# EAGLE design standalone (EAGLE 6.3)
AUTHOR: Ashley Grealish; VERSION: 0.1
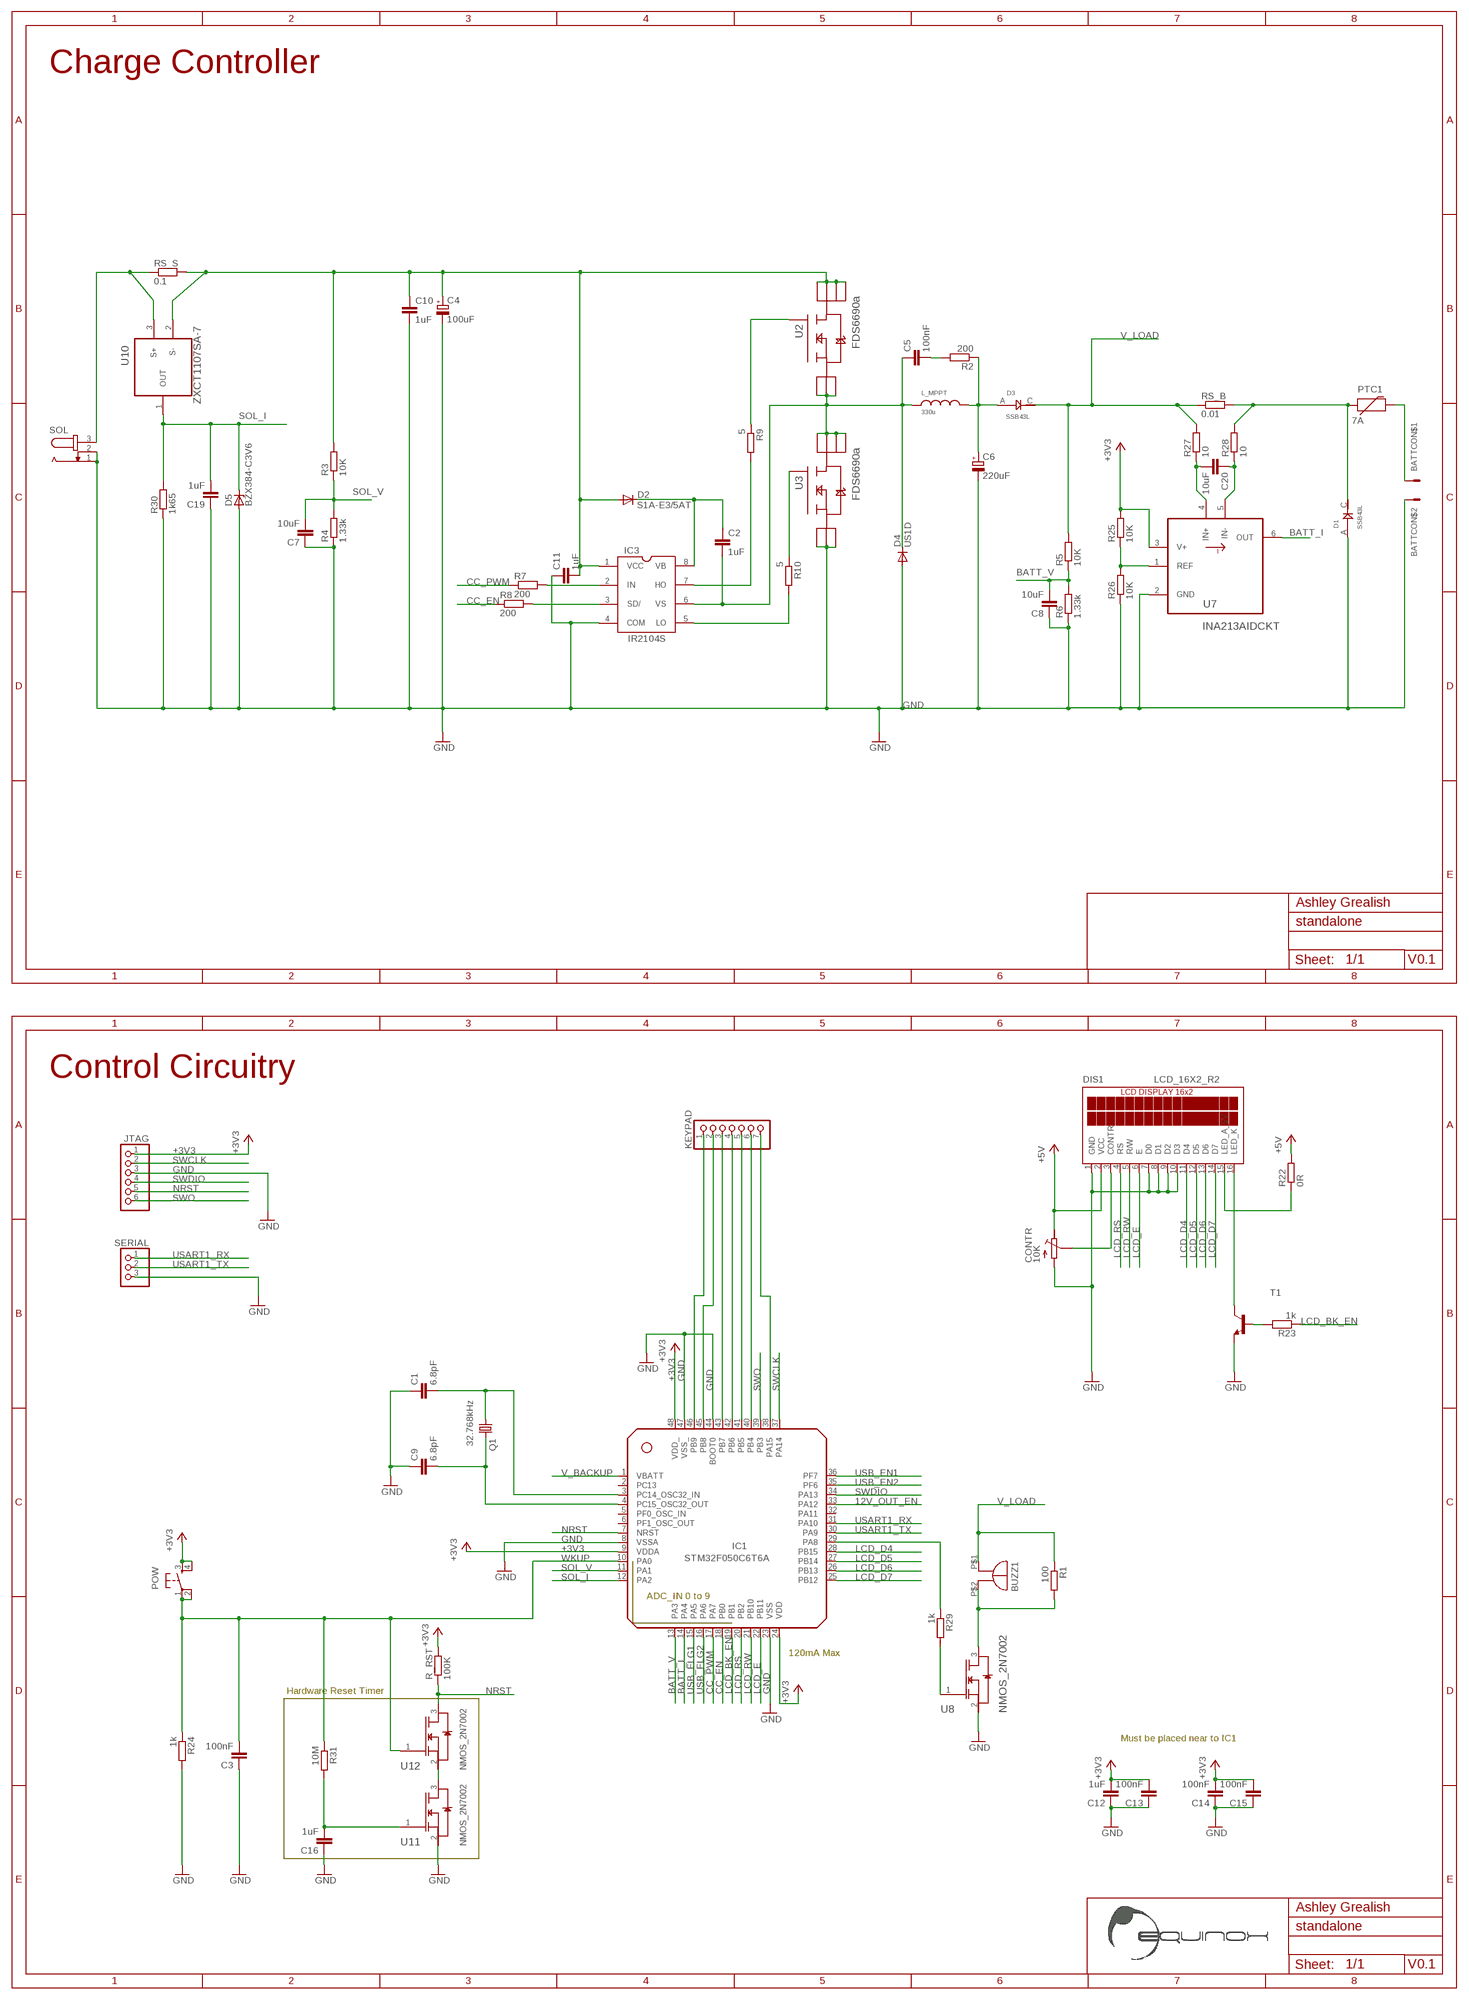
[diagram p0: schematic, sheet 1, part 1 of 2]
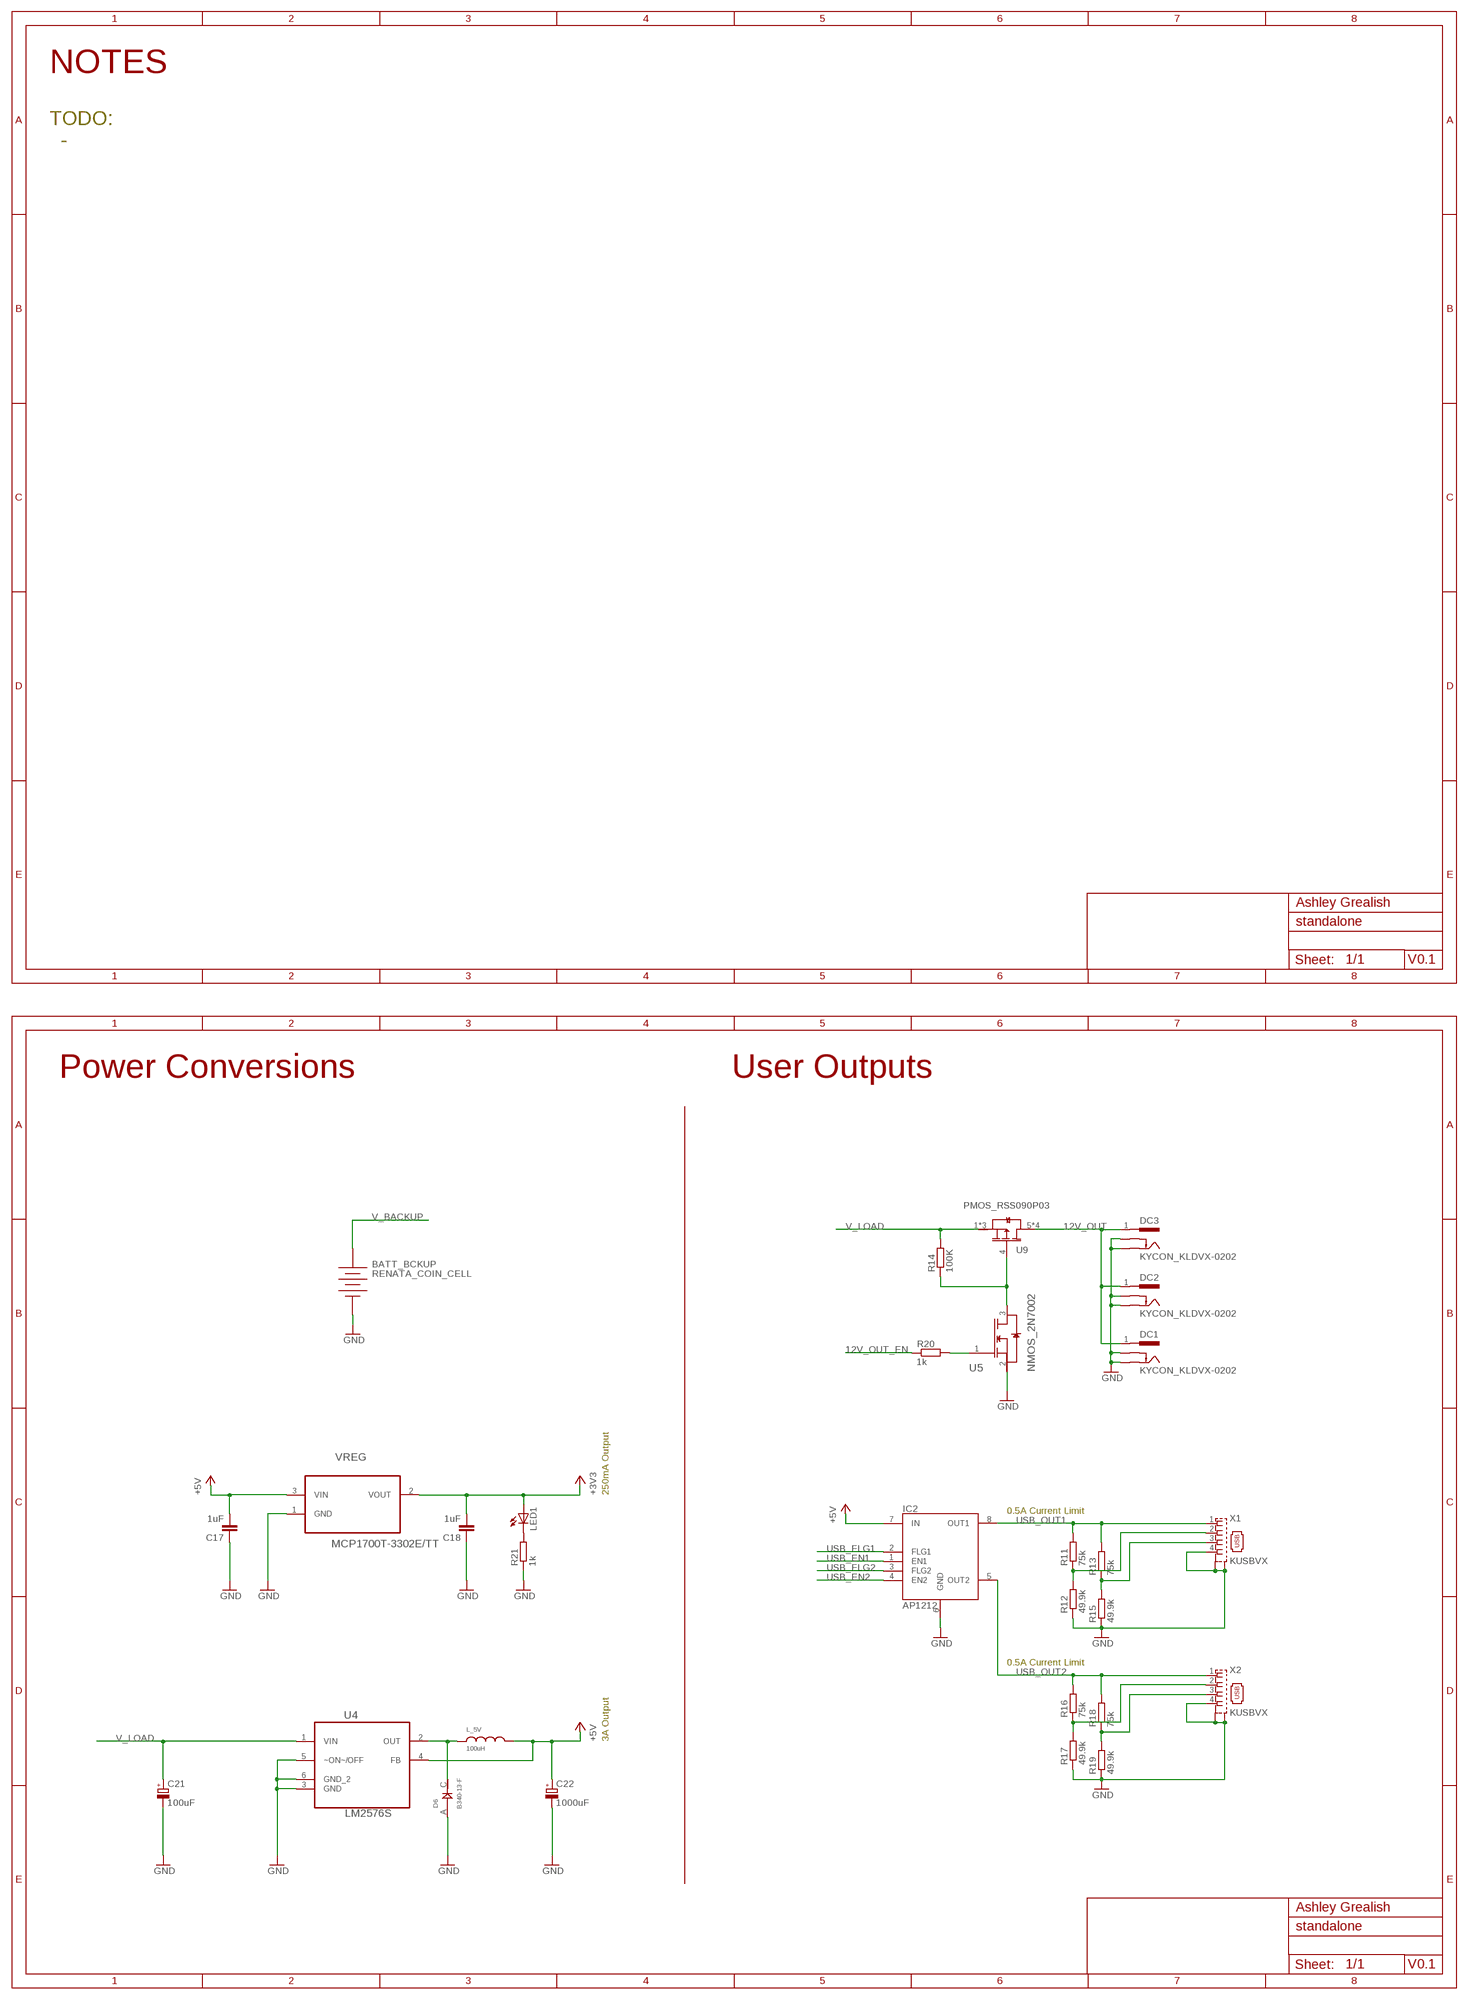
[diagram p1: schematic, sheet 1, part 2 of 2]

## Parts
BATT  CON_MOLEX_39_29_1028  [MOLEX_39_29_1028]
BATT_BCKUP  RENATA_COIN_CELL  PANASONIC_CR2032_1298246  [PANASONIC_CR2032_1298246]
BUZZ1  BUZZ_14MM  [BUZZ_14MM_5M_PINS]
C1  6.8pF  C-EUC0603K  [C0603K]
C2  1uF  C-EUC0805K  [C0805K]
C3  100nF  C-EUC0805K  [C0805K]
C4  100uF  CPOL-EUE  [PANASONIC_E]
C5  100nF  C-EUC0805K  [C0805K]
C6  220uF  CPOL-EUF  [PANASONIC_F]
C7  10uF  C-EUC0805K  [C0805K]
C8  10uF  C-EUC0805K  [C0805K]
C9  6.8pF  C-EUC0603K  [C0603K]
C10  1uF  C-EUC0805K  [C0805K]
C11  1uF  C-EUC0805K  [C0805K]
C12  1uF  C-EUC0805K  [C0805K]
C13  100nF  C-EUC0805K  [C0805K]
C14  100nF  C-EUC0805K  [C0805K]
C15  100nF  C-EUC0805K  [C0805K]
C16  1uF  C-EUC0805K  [C0805K]
C17  1uF  C-EUC0805K  [C0805K]
C18  1uF  C-EUC0805K  [C0805K]
C19  1uF  C-EUC0805K  [C0805K]
C20  10uF  C-EUC0805K  [C0805K]
C21  100uF  CPOL-EUE  [PANASONIC_E]
C22  1000uF  CPOL-EUG  [PANASONIC_G]
CONTR  10K  R_TRIMM_TC33X  [R_TRIMM_RC33X]
D1  SSB43L  DIODE_SSB43L  [DO214AA]
D2  S1A-E3/5AT  DIODE-DO-214AC  [DO-214AC]
D3  SSB43L  DIODE_SSB43L  [DO214AA]
D4  US1D  DIODE-DO-214AC  [DO-214AC]
D5  BZX384-C3V6  [SOD323]
D6  B340-13-F  DIODE_B340-13-F  [SMC]
DC1  KYCON_KLDVX-0202  [KYCON_KLVDX_2020_B]
DC2  KYCON_KLDVX-0202  [KYCON_KLVDX_2020_B]
DC3  KYCON_KLDVX-0202  [KYCON_KLVDX_2020_B]
DIS1  LCD_16X2_R2  [LCD_16X2_R2]
IC1  STM32F050C6T6A  [LQFP48]
IC2  AP1212  [SO8]
IC3  IR2104S  [IR2104S]
JTAG  PINHD-1X6  [1X06]
KEYPAD  PINHD-1X7/90  [1X07/90]
L_5V  100uH  INDUC_BOURNES_SDR2207  [INDUC_BOURNS_SDR2207]
L_MPPT  330u  INDUC_BOURNES_SDR1806  [INDUC_BOURNS_SDR1806]
LED1  POW_3V3  LEDCHIPLED_0805  [CHIPLED_0805]
POW  TAC_SWITCHPTH  [TACTILE-PTH]
PTC1  7A  PTC_MF_R700  [PTC_MF_R700]
Q1  32.768kHz  MC-306  [MC-306]
R1  100  R-EU_M0805  [M0805]
R2  200  R-EU_M0805  [M0805]
R3  10K  R-EU_M0805  [M0805]
R4  1.33k  R-EU_M0805  [M0805]
R5  10K  R-EU_M0805  [M0805]
R6  1.33k  R-EU_M0805  [M0805]
R7  200  R-EU_M0805  [M0805]
R8  200  R-EU_M0805  [M0805]
R9  5  R-EU_M0805  [M0805]
R10  5  R-EU_M0805  [M0805]
R11  75k  R-EU_M0805  [M0805]
R12  49.9k  R-EU_M0805  [M0805]
R13  75k  R-EU_M0805  [M0805]
R14  100K  R-EU_M0805  [M0805]
R15  49.9k  R-EU_M0805  [M0805]
R16  75k  R-EU_M0805  [M0805]
R17  49.9k  R-EU_M0805  [M0805]
R18  75k  R-EU_M0805  [M0805]
R19  49.9k  R-EU_M0805  [M0805]
R20  1k  R-EU_M0805  [M0805]
R21  1k  R-EU_M0805  [M0805]
R22  0R  R-EU_M0805  [M0805]
R23  1k  R-EU_M0805  [M0805]
R24  1k  R-EU_M0805  [M0805]
R25  10K  R-EU_M0805  [M0805]
R26  10K  R-EU_M0805  [M0805]
R27  10  R-EU_M0805  [M0805]
R28  10  R-EU_M0805  [M0805]
R29  1k  R-EU_M0805  [M0805]
R30  1k65  R-EU_M0805  [M0805]
R31  10M  R-EU_M0805  [M0805]
R_RST  100K  R-EU_M0805  [M0805]
RS_B  0.01  R-EU_R2512  [R2512]
RS_S  0.1  R-EU_R2512  [R2512]
SERIAL  PINHD-1X3  [1X03]
SOL  JACK-PLUG0  [SPC4077]
T1  BC847B-NPN-SOT23-BEC  [SOT23-BEC]
U2  FDS6690a  DMS3016SSS-13  [SOIC127P600X175-8N]
U3  FDS6690a  DMS3016SSS-13  [SOIC127P600X175-8N]
U4  LM2576S  [TO263-5]
U5  NMOS_2N7002  [SOT103P240X110-3N]
U7  INA213AIDCKT  [SOT65P210X110-6N]
U8  NMOS_2N7002  [SOT103P240X110-3N]
U9  PMOS_RSS090P03  [SO8]
U10  ZXCT1107SA-7  [SOT91P240X110-3N]
U11  NMOS_2N7002  [SOT103P240X110-3N]
U12  NMOS_2N7002  [SOT103P240X110-3N]
U$1  EQUINOX_LOGO_LARGE  [EQUINOX_LOGO_LARGE]
VREG  MCP1700T-3302E/TT  [SOT95P237X112-3N]
X1  KUSBVX  [KUSBVX]
X2  KUSBVX  [KUSBVX]

## Nets
12V_OUT [pow_12v]: DC1.1(PAD1) DC2.1(PAD1) DC3.1(PAD1) U9.5(D2) U9.6(D2) U9.7(D2) U9.8(D2)
12V_OUT_EN: IC1.33(PA12) R20.1
+3V3: C12.2 C13.2 C14.2 C15.2 C18.2 IC1.9(VDDA) IC1.24(VDD) IC1.48(VDD_) JTAG.1 LED1.A POW.3 POW.4 R25.2 R_RST.2 U7.3(V+) VREG.2(VOUT)
+5V: C17.2 C22.+ CONTR.CW(A) DIS1.2(VCC) IC2.7(IN) L_5V.P$2 R22.2 U4.4(FB) VREG.3(VIN)
BATT_I: IC1.14(PA4) U7.6(OUT)
BATT_V: C8.2 IC1.13(PA3) R5.1 R6.2
CC_EN: IC1.18(PB0) R8.1
CC_PWM: IC1.17(PA7) R7.1
GND [pwr]: BATT.P$2 BATT_BCKUP.P-(NEG) C1.1 C3.1 C4.- C6.- C7.1 C8.1 C9.1 C10.2 C11.1 C12.1 C13.1 C14.1 C15.1 C16.1 C17.1 C18.1 C19.1 C21.- C22.- CONTR.CCW(E) D1.A(ANODE) D4.A D5.A D6.A(ANODE) DC1.2(PAD2) DC1.3(PAD3) DC2.2(PAD2) DC2.3(PAD3) DC3.2(PAD2) DC3.3(PAD3) DIS1.1(GND) DIS1.7(D0) DIS1.8(D1) DIS1.9(D2) DIS1.10(D3) IC1.8(VSSA) IC1.23(VSS) IC1.44(BOOT0) IC1.47(VSS_) IC2.6(GND) IC3.4(COM) JTAG.3 R4.1 R6.1 R12.1 R15.1 R17.1 R19.1 R21.1 R24.2 R26.1 R30.1 SERIAL.3 SOL.1 SOL.2 T1.E U3.1(S_2) U3.2(S_3) U3.3(S) U4.3(GND) U4.5(~ON~/OFF) U4.6(GND_2) U5.2(S) U7.2(GND) U8.2(S) U11.2(S) VREG.1(GND) X1.4 X1.M1(S1) X1.M2(S2) X2.4 X2.M1(S1) X2.M2(S2)
LCD_BK_EN: IC1.19(PB1) R23.1
LCD_D4: DIS1.11(D4) IC1.28(PB15)
LCD_D5: DIS1.12(D5) IC1.27(PB14)
LCD_D6: DIS1.13(D6) IC1.26(PB13)
LCD_D7: DIS1.14(D7) IC1.25(PB12)
LCD_E: DIS1.6(E) IC1.22(PB11)
LCD_RS: DIS1.4(RS) IC1.20(PB2)
LCD_RW: DIS1.5(R/W) IC1.21(PB10)
N$1: C1.2 IC1.3(PC14_OSC32_IN) Q1.1
N$2: CONTR.WIPE(S) DIS1.3(CONTR)
N$3: IC3.3(SD/) R8.2
N$4 [pwr]: D1.C(CATHODE) PTC1.P$1 R28.2 RS_B.2
N$6 [pwr]: C2.2 C5.1 D4.C IC3.6(VS) L_MPPT.P$1 U2.1(S_2) U2.2(S_3) U2.3(S) U3.5(D_3) U3.6(D_2) U3.7(D_4) U3.8(D)
N$7: IC3.7(HO) R9.2
N$8: IC3.2(IN) R7.2
N$10: C2.1 D2.C IC3.8(VB)
N$11: R10.1 U3.4(G)
N$12: C6.+ D3.A(ANODE) L_MPPT.P$2 R2.1
N$13: IC3.5(LO) R10.2
N$14: R9.1 U2.4(G)
N$15: C5.2 R2.2
N$16 [pwr]: C4.+ C10.1 C11.2 D2.A IC3.1(VCC) R3.2 RS_S.2 U2.5(D_3) U2.6(D_2) U2.7(D_4) U2.8(D) U10.2(S-)
N$18: C9.2 IC1.4(PC15_OSC32_OUT) Q1.4
N$19: DIS1.15(LED_A_5V) R22.1
N$20: R16.1 R17.2 X2.2
N$21: D6.C(CATHODE) L_5V.P$1 U4.2(OUT)
N$22: IC1.29(PA8) R29.1
N$23: IC1.46(PB9) KEYPAD.1
N$24: IC1.45(PB8) KEYPAD.2
N$25: R14.1 U5.3(D) U9.4(G)
N$26: IC1.43(PB7) KEYPAD.3
N$27: IC1.42(PB6) KEYPAD.4
N$28: IC1.41(PB5) KEYPAD.5
N$29: IC1.40(PB4) KEYPAD.6
N$30: IC1.38(PA15) KEYPAD.7
N$31: DIS1.16(LED_K) T1.C
N$32: R23.2 T1.B
N$33: R11.1 R12.2 X1.2
N$34: R13.1 R15.2 X1.3
N$35: R20.2 U5.1(G)
N$36: R18.1 R19.2 X2.3
N$37: LED1.C R21.2
N$38 [pwr]: RS_S.1 SOL.3 U10.3(S+)
N$39: R25.1 R26.2 U7.1(REF)
N$40: C20.2 R27.1 U7.4(IN+)
N$41: C20.1 R28.1 U7.5(IN-)
N$42: BUZZ1.P$2(-) R1.2 U8.3(D)
N$43: R29.2 U8.1(G)
N$44: C16.2 R31.2 U11.1(G)
N$45: U11.3(D) U12.2(S)
N$46 [pwr]: BATT.P$1 PTC1.P$2
NRST: IC1.7(NRST) JTAG.5 R_RST.1 U12.3(D)
SOL_I: C19.2 D5.C IC1.12(PA2) R30.2 U10.1(OUT)
SOL_V: C7.2 IC1.11(PA1) R3.1 R4.2
SWCLK: IC1.37(PA14) JTAG.2
SWDIO: IC1.34(PA13) JTAG.4
SWO: IC1.39(PB3) JTAG.6
USART1_RX: IC1.31(PA10) SERIAL.1
USART1_TX: IC1.30(PA9) SERIAL.2
USB_EN1: IC1.36(PF7) IC2.1(EN1)
USB_EN2: IC1.35(PF6) IC2.4(EN2)
USB_FLG1: IC1.15(PA5) IC2.2(FLG1)
USB_FLG2: IC1.16(PA6) IC2.3(FLG2)
USB_OUT1 [pwr]: IC2.8(OUT1) R11.2 R13.2 X1.1
USB_OUT2 [pwr]: IC2.5(OUT2) R16.2 R18.2 X2.1
V_BACKUP: BATT_BCKUP.P+(POS) IC1.1(VBATT)
V_LOAD: BUZZ1.P$1(+) C21.+ D3.C(CATHODE) R1.1 R5.2 R14.2 R27.2 RS_B.1 U4.1(VIN) U9.1(S2) U9.2(S2) U9.3(S2)
WKUP: C3.2 IC1.10(PA0) POW.1 POW.2 R24.1 R31.1 U12.1(G)
Unconnected: IC1.2(PC13) IC1.5(PF0_OSC_IN) IC1.6(PF1_OSC_OUT) IC1.32(PA11)

## Notes on the sheet
- Charge Controller | NOTES
- TODO:
    -
- V | V
- Control Circuitry | Power Conversions | User Outputs
- 250mA Output
- 0.5A Current Limit
- ADC_IN 0 to 9
- 120mA Max
- 0.5A Current Limit
- Hardware Reset Timer
- Must be placed near to IC1 | 3A Output
- V | V

## Library data of the parts
BATT = equinox:CON_MOLEX_39_29_1028; OC_FARNELL: 1012166
BATT_BCKUP = coin_cells:PANASONIC_CR2032_1298246: Farnell Part No: 1298246; OC_FARNELL: 1298246
BUZZ1 = equinox:BUZZ_14MM; OC_FARNELL: 1192513
C1 C9 = resistor:C-EU: CAPACITOR, European symbol; OC_FARNELL: 1856141
C2 C3 C5 C7 C8 C10-C20 = resistor:C-EU: CAPACITOR, European symbol
C4 C21 = resistor:CPOL-EU: POLARIZED CAPACITOR, European symbol; OC_FARNELL: 1539489
C6 = resistor:CPOL-EU: POLARIZED CAPACITOR, European symbol; OC_FARNELL: 9695877
C22 = resistor:CPOL-EU: POLARIZED CAPACITOR, European symbol; OC_FARNELL: 1244342
CONTR = equinox:R_TRIMM_TC33X; OC_FARNELL: 1689863; OC_MOUSER: 652-TC33X-2-103E
D1 D3 = equinox:DIODE_SSB43L: VISHAY - SSB43L-E3/52T - DIODE, SCHOTTKY, 4A, 30V Farnell: 1336556; OC_FARNELL: 1336556
D2 = diode:DIODE-: DIODE; OC_FARNELL: 9550216
D4 = diode:DIODE-: DIODE; OC_FARNELL: 1625280
D5 = equinox:BZX384-C3V6; OC_FARNELL: 8735654
D6 = equinox:DIODE_B340-13-F; OC_FARNELL: 1843695
DC1-DC3 = equinox:KYCON_KLDVX-0202; TOBY: DC-031-B
DIS1 = equinox:LCD_16X2_R2: Supplier: info <info@huaxinjin.com> Model: 1602C-1; OC_FARNELL: unknown; OC_NEWARK: unknown
IC1 = equinox:STM32F050C6T6A; OC_FARNELL: 2115059
IC2 = equinox:AP1212: Datasheet: http://www.farnell.com/datasheets/608767.pdf Can be replaced with newer AP2156SG-13 RS:http://uk.rs-online.com/web/p/products/7512963P/?cm_mmc=aff-_-uk-_-octopart-_-7512963P; OC_FARNELL: 1825302
IC3 = equinox:IR2104S: Half Bridge Mosfet - IGBT driver SOIC; OC_FARNELL: 8638756
JTAG = pinhead:PINHD-1X6: PIN HEADER
KEYPAD = pinhead:PINHD-1X7: PIN HEADER; OC_FARNELL: 588763
L_5V = equinox:INDUC_BOURNES_SDR2207; FARNELL: 1612709; OC_FARNELL: 1612709
L_MPPT = equinox:INDUC_BOURNES_SDR1806: Datasheet: http://www.bourns.com/data/global/pdfs/SDR1806.pdf Onecall #: 1929705; OC_FARNELL: 1929706
LED1 = led:LED: LED OSRAM: - CHIPLED LG R971, LG N971, LY N971, LG Q971, LY Q971, LO R971, LY R971 LH N974, LH R974 LS Q976, LO Q976, LY Q976 LO Q996 - Hyper CHIPLED LW Q18S LB Q993, LB Q99A, LB R99A - SideLED LS A670, LO A670, LY A670, LG A670, LP A670 LB A673, LV A673, LT A673, LW A673 LH A674 LY A675 LS A676, LA A676, LO A676, LY A676, LW A676 LS A679, LY A679, LG A679 - Hyper Micro SIDELED® LS Y876, LA Y876, LO Y876, LY Y876 LT Y87S - SmartLED LW L88C, LW L88S LB L89C, LB L89S, LG L890 LS L89K, LO L89K, LY L89K LS L896, LA L896, LO L896, LY L896 - TOPLED LS T670, LO T670, LY T670, LG T670, LP T670 LSG T670, LSP T670, LSY T670, LOP T670, LYG T670 LG T671, LOG T671, LSG T671 LB T673, LV T673, LT T673, LW T673 LH T674 LS T676, LA T676, LO T676, LY T676, LB T676, LH T676, LSB T676, LW T676 LB T67C, LV T67C, LT T67C, LS T67K, LO T67K, LY T67K, LW E67C LS E67B, LA E67B, LO E67B, LY E67B, LB E67C, LV E67C, LT E67C LW T67C LS T679, LY T679, LG T679 LS T770, LO T770, LY T770, LG T770, LP T770 LB T773, LV T773, LT T773, LW T773 LH T774 LS E675, LA E675, LY E675, LS T675 LS T776, LA T776, LO T776, LY T776, LB T776 LHGB T686 LT T68C, LB T68C - Hyper Mini TOPLED® LB M676 - Mini TOPLED Santana® LG M470 LS M47K, LO M47K, LY M47K Source: http://www.osram.convergy.de LUXEON: - LUMILED® LXK2-PW12-R00, LXK2-PW12-S00, LXK2-PW14-U00, LXK2-PW14-V00 LXK2-PM12-R00, LXK2-PM12-S00, LXK2-PM14-U00 LXK2-PE12-Q00, LXK2-PE12-R00, LXK2-PE12-S00, LXK2-PE14-T00, LXK2-PE14-U00 LXK2-PB12-K00, LXK2-PB12-L00, LXK2-PB12-M00, LXK2-PB14-N00, LXK2-PB14-P00, LXK2-PB14-Q00 LXK2-PR12-L00, LXK2-PR12-M00, LXK2-PR14-Q00, LXK2-PR14-R00 LXK2-PD12-Q00, LXK2-PD12-R00, LXK2-PD12-S00 LXK2-PH12-R00, LXK2-PH12-S00 LXK2-PL12-P00, LXK2-PL12-Q00, LXK2-PL12-R00 Source: www.luxeon.com KINGBRIGHT: KA-3528ASYC Source: www.kingbright.com
POW = equinox:TAC_SWITCH: Momentary Switch Button commonly used for reset or general input. Spark Fun Electronics SKU : COM-00097; RS: 758-1979
PTC1 = equinox:PTC_MF_R700; OC_FARNELL: 9350551
Q1 = crystal:MC-306: kHz RANGE CRYSTAL UNIT SMD Source: MC-306_405_406_E07X.PDF Homepage <http://www.epsontoyocom.co.jp>; MPN: MC-306; OC_FARNELL: 1712823; OC_NEWARK: -
R1 R11-R13 R15-R19 R21-R24 R29 R31 = resistor:R-EU_: RESISTOR, European symbol
R2-R10 R14 R20 R25-R28 R30 R_RST RS_B RS_S = rcl:R-EU_: RESISTOR, European symbol
SERIAL = pinhead:PINHD-1X3: PIN HEADER
SOL = con-jack:JACK-PLUG: DC POWER JACK Power Jack, DC, Right Angle, Through Hole, Rated 5A at 16VDC, PC Terminals Distributor: Farnell (www.Farnell.de) Drawing: 84N1161.pdf / 84N1162.pdf Manufacturer: SPC Technology (www.spctechnology.com) Type: SPC4077 / SPC 4078; OC_FARNELL: unknown; OC_NEWARK: unknown; TOBY: DC-001-A-2.1mm-R
T1 = transistor:*-NPN-: NPN Transistror BF959 corrected 2008.03.06; OC_FARNELL: 1081232
U2 U3 = equinox:DMS3016SSS-13: ENHANCEMENT MODE MOSFET; OC_FARNELL: 9845275; PACKAGE: SOIC-8
U4 = equinox:LM2576S; OC_FARNELL: 1469178
U5 U8 U11 U12 = equinox:NMOS_2N7002: N-CHANNEL ENHANCEMENT MODE FIELD EFFECT TRANSISTOR; MPN: 2N7002-7-F; OC_FARNELL: 1713823; OC_NEWARK: 25R5679; PACKAGE: SOT-23-3; SUPPLIER: DIODES INC.
U7 = equinox:INA213AIDCKT: CURRENT SHUNT MONITOR; MPN: INA213AIDCKT; OC_FARNELL: 1754261; OC_NEWARK: 05N1040; PACKAGE: SC-70-6; SUPPLIER: Texas Instruments
U9 = equinox:PMOS_RSS090P03; FARNELL: 1525544; OC_FARNELL: 1525544
U10 = equinox:ZXCT1107SA-7: LOW POWER HIGH-SIDE CURRENT MONITORS; MPN: ZXCT1107SA-7; OC_FARNELL: 1904027; OC_NEWARK: 55T4047; PACKAGE: SOT-23-3; SUPPLIER: DIODES INC.
U$1 = equinox:EQUINOX_LOGO_LARGE
VREG = equinox:MCP1700T-3302E/TT: Low Quiescent Current LDO; MPN: MCP1700T-3302E/TT; OC_FARNELL: 1296592; OC_NEWARK: 88H9817; PACKAGE: SOT23-3; SUPPLIER: Microchip
X1 X2 = con-kycon:KUSBVX: Vertical,Top Entry Universal Serial Bus Connector KUSBVX Series Source: KYCON Sibalco USB vertical socket KUSBV.pdf

## Net classes
0 default: width 0.381 mm, drill 0.6 mm, clearance 0.254 mm
1 pwr: width 0.381 mm, drill 0.6 mm, clearance 0.381 mm
2 pow_12v: width 0.381 mm, drill 0.6 mm, clearance 0.381 mm
3 gnd: width 0.381 mm, drill 0.6 mm

## Board
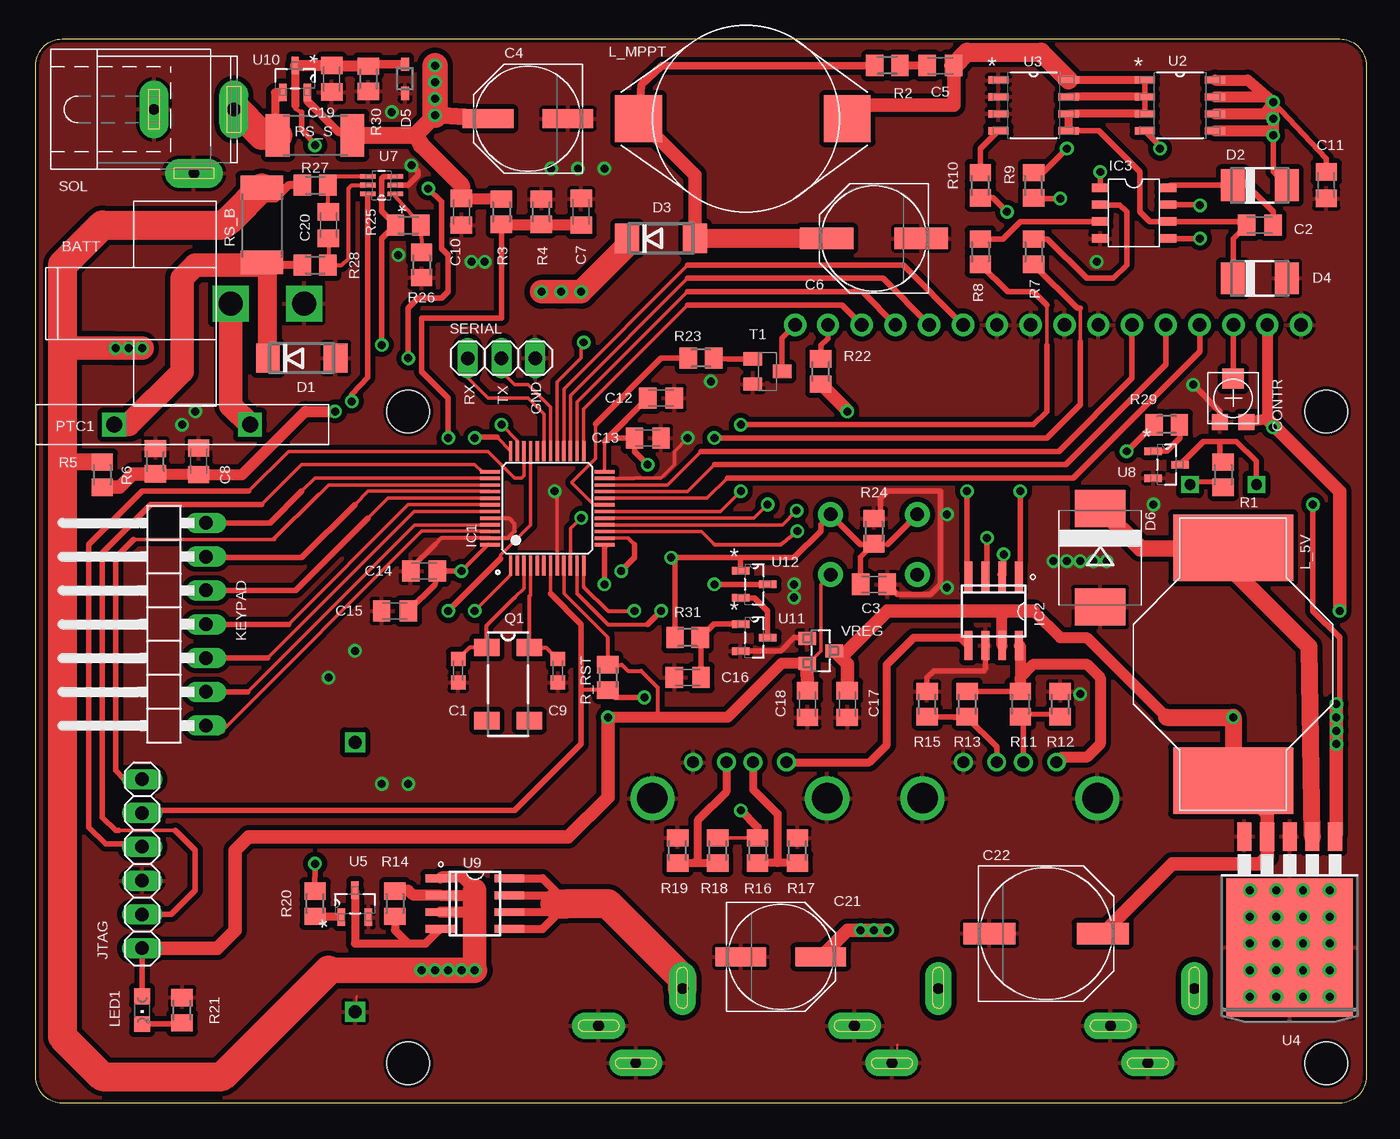
[diagram p2: board, top side]
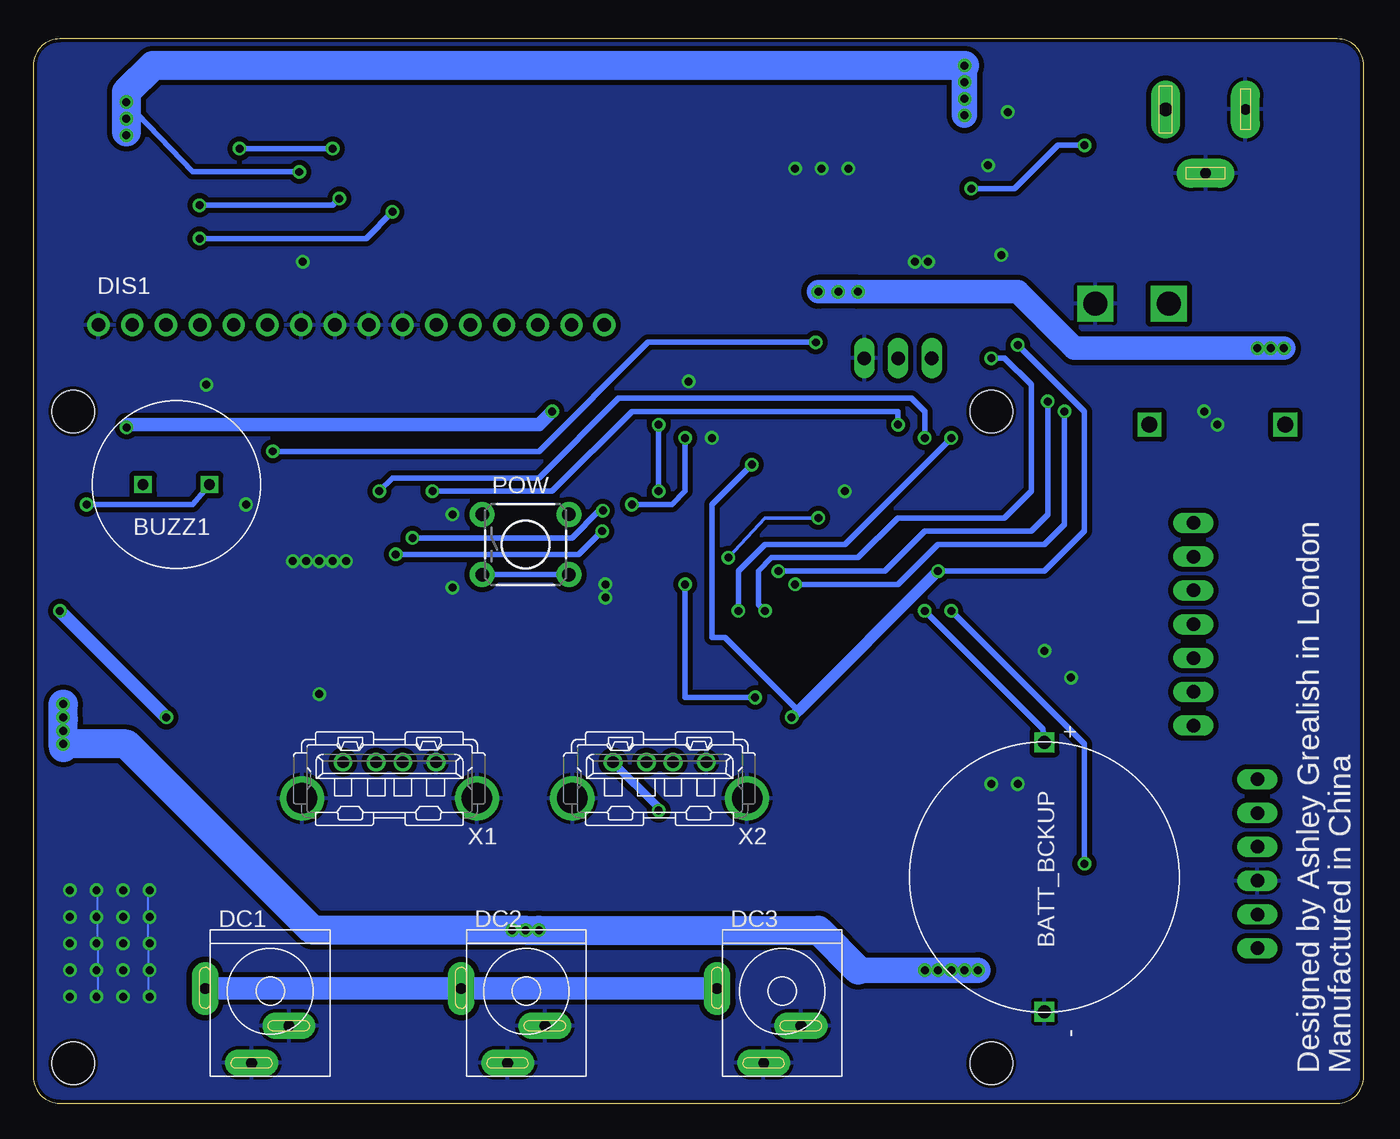
[diagram p3: board, bottom side, seen from below]

Size 100 x 80 mm. Coordinates in mm from the lower left corner, seen from the top.
Outline: 100,78 100,2 arc-90 98,0 2,0 arc-90 0,2 0,78 arc-90 2,80 98,80 arc-90 100,78
Copper layers (1*16): Top 0.035mm / dielectric 1.5mm / Bottom 0.035mm
Design rules "Fusion_eagle_rule_v1.1": minimum track width 6mil, minimum drill 12mil, track to track 6mil, track to pad 6mil, pad to pad 6mil, via to via 6mil, smd to smd 0mil, copper to edge 10mil, drill to drill 10mil, minimum pad ring 10mil, minimum via ring 6mil, stop-mask expansion 2mil, vias tented up to drill 100mil, thermal gap 10mil
Holes 3.2 mm at 28,52 28,3 97,3 97,52

### Footprints (pad centres in the part's own frame; a part is rotated, then mirrored left to right if it is on the bottom)
MOLEX_39_29_1028 = drill 1.8 square: P$1 0,0; P$2 0,5.5
PANASONIC_CR2032_1298246 = drill 1 square: P+ -10.125,0; P- 10.125,0
BUZZ_14MM_5M_PINS = drill 0.8 square: P$1 -2.5,0; P$2 2.5,0
C0603K = smd 1.05 x 1.08: 1 -0.875,0; 2 0.875,0
C0805K = smd 1.3 x 1.6: 1 -1,0; 2 1,0
PANASONIC_E = smd 3.8 x 1.4: + 3,0; - -3,0
PANASONIC_F = smd 4 x 1.6: + 3.55,0; - -3.55,0
PANASONIC_G = smd 3.9 x 1.6: + 4.25,0; - -4.25,0
R_TRIMM_RC33X = smd 1.194 x 1.194: CCW -1,-1.8; CW 1,-1.8 | smd 1.6 x 1.5: WIPE 0,1.45
DO214AA = smd 1.8 x 2.2: A 2.55,0; C -2.55,0
DO-214AC = smd 1.8 x 2.4: A 2.025,0; C -2.025,0
SOD323 = smd 1 x 0.6: A 1.1,0; C -1.1,0
SMC = smd 2.8 x 3.8: A 3.7,0; C -3.7,0
KYCON_KLVDX_2020_B = drill 0.813 pad 2 long: 1 -4.845,0.25; 2 -1.345,-5.35; 3 1.455,-2.55
LCD_16X2_R2 = drill 1 pad 1.676: 1 8,2.5; 2 10.54,2.5; 3 13.08,2.5; 4 15.62,2.5; 5 18.16,2.5; 6 20.7,2.5; 7 23.24,2.5; 8 25.78,2.5; 9 28.32,2.5; 10 30.86,2.5; 11 33.4,2.5; 12 35.94,2.5; 13 38.48,2.5; 14 41.02,2.5; 15 43.56,2.5; 16 46.01,2.5
LQFP48 = smd 1.5 x 0.25: 1 -4.3,2.75; 2 -4.3,2.25; 3 -4.3,1.75; 4 -4.3,1.25; 5 -4.3,0.75; 6 -4.3,0.25; 7 -4.3,-0.25; 8 -4.3,-0.75; 9 -4.3,-1.25; 10 -4.3,-1.75; 11 -4.3,-2.25; 12 -4.3,-2.75; 25 4.3,-2.75; 26 4.3,-2.25; 27 4.3,-1.75; 28 4.3,-1.25; 29 4.3,-0.75; 30 4.3,-0.25; 31 4.3,0.25; 32 4.3,0.75; 33 4.3,1.25; 34 4.3,1.75; 35 4.3,2.25; 36 4.3,2.75 | smd 0.25 x 1.5: 13 -2.75,-4.3; 14 -2.25,-4.3; 15 -1.75,-4.3; 16 -1.25,-4.3; 17 -0.75,-4.3; 18 -0.25,-4.3; 19 0.25,-4.3; 20 0.75,-4.3; 21 1.25,-4.3; 22 1.75,-4.3; 23 2.25,-4.3; 24 2.75,-4.3; 37 2.75,4.3; 38 2.25,4.3; 39 1.75,4.3; 40 1.25,4.3; 41 0.75,4.3; 42 0.25,4.3; 43 -0.25,4.3; 44 -0.75,4.3; 45 -1.25,4.3; 46 -1.75,4.3; 47 -2.25,4.3; 48 -2.75,4.3
SO8 = smd 0.6 x 2.2: 1 -1.905,-2.6; 2 -0.635,-2.6; 3 0.635,-2.6; 4 1.905,-2.6; 5 1.905,2.6; 6 0.635,2.6; 7 -0.635,2.6; 8 -1.905,2.6
IR2104S = smd 1.27 x 0.635: 1 0,3.81; 2 0,2.54; 3 0,1.27; 4 0,0; 5 5.08,0; 6 5.08,1.27; 7 5.08,2.54; 8 5.08,3.81
1X06 = drill 1.016 long: 1 -6.35,0; 2 -3.81,0; 3 -1.27,0; 4 1.27,0; 5 3.81,0; 6 6.35,0
1X07/90 = drill 1.016 long: 1 -7.62,-3.81; 2 -5.08,-3.81; 3 -2.54,-3.81; 4 0,-3.81; 5 2.54,-3.81; 6 5.08,-3.81; 7 7.62,-3.81
INDUC_BOURNS_SDR2207 = smd 5 x 9: P$1 -8.75,0; P$2 8.75,0
INDUC_BOURNS_SDR1806 = smd 3.5 x 3.5: P$1 0,0; P$2 15.697,0
CHIPLED_0805 = smd 1.2 x 1.2: A 0,-1.05; C 0,1.05
TACTILE-PTH = drill 1.016 pad 1.88: 1 -3.251,2.261; 2 3.251,2.261; 3 -3.251,-2.261; 4 3.251,-2.261
PTC_MF_R700 = drill 1.2 square: P$1 -5.1,0; P$2 5.1,0
MC-306 = smd 1.3 x 1.9: 1 -2.75,-1.6; 2 2.75,-1.6; 3 2.75,1.6; 4 -2.75,1.6
M0805 = smd 1.3 x 1.6: 1 -0.95,0; 2 0.95,0
R2512 = smd 1.8 x 3.2: 1 -2.8,0; 2 2.8,0
1X03 = drill 1.016 long: 1 -2.54,0; 2 0,0; 3 2.54,0
SPC4077 = drill 0.8 pad 2.184 long: 1 -3,0; 2 0,-4.8 | drill 1 pad 2.184 long: 3 3,0
SOT23-BEC = smd 1 x 1.4: B -0.95,-1.1; C 0,1.1; E 0.95,-1.1
SOIC127P600X175-8N = smd 1.524 x 0.559: 1 -2.642,1.905; 2 -2.642,0.635; 3 -2.642,-0.635; 4 -2.642,-1.905; 5 2.642,-1.905; 6 2.642,-0.635; 7 2.642,0.635; 8 2.642,1.905
TO263-5 = smd 1.067 x 2.159: 1 -3.404,-5.791; 2 -1.702,-5.791; 3 0,-5.791; 4 1.702,-5.791; 5 3.404,-5.791 | smd 9.5 x 10.41: 6 0,2.54
SOT103P240X110-3N = smd 1.321 x 0.559: 1 -1.016,1.016; 2 -1.016,-1.016; 3 1.016,0
SOT65P210X110-6N = smd 1.168 x 0.356: 1 -1.041,0.66; 2 -1.041,0; 3 -1.041,-0.66; 4 1.041,-0.66; 5 1.041,0; 6 1.041,0.66
SOT91P240X110-3N = smd 1.321 x 0.559: 1 -1.016,0; 2 1.016,0.914; 3 1.016,-0.914
SOT95P237X112-3N = smd 0.991 x 1.321: 1 -0.94,-1.016; 2 0.94,-1.016; 3 0,1.016
KUSBVX = drill 0.9 pad 1.3: 1 3.5,0; 2 1,0; 3 -1,0; 4 -3.5,0 | drill 2.3 pad 2.8: M1 -6.57,2.71; M2 6.57,2.71

### Placement (x,y rotation side)
BATT  14.66,60.09 270 top
BATT_BCKUP  24,17 270 bottom
BUZZ1  89.25,46.5 180 bottom
C1  31.75,32.5 90 top
C2  92,66 180 top
C3  63,39 180 top
C4  37,74 180 top
C5  68,78 180 top
C6  63,65 180 top
C7  41,67 270 top
C8  12.25,48.25 270 top
C9  39.25,32.5 90 top
C10  32,67 270 top
C11  97,69 90 top
C12  47,53 180 top
C13  46,50 180 top
C14  29.19,40 0 top
C15  27,37 0 top
C16  49,32 0 top
C17  61,30 90 top
C18  58,30 90 top
C19  22.25,77 90 top
C20  22,66 90 top
C21  56,11 0 top
C22  75.94,12.75 0 top
CONTR  90,53 0 top
D1  20,56 0 top
D2  92,69 0 top
D3  47,65 0 top
D4  92,62 0 top
D5  27.75,77 270 top
D6  80,41 270 top
DC1  82.24,8.37 0 bottom
DC2  63,8.37 0 bottom
DC3  43.76,8.37 0 bottom
DIS1  103.1,56 0 bottom
IC1  38.44,44.72 90 top
IC2  72,37 180 top
IC3  80,65 0 top
JTAG  8,18 90 top
KEYPAD  9,36 90 top
L_5V  90,33 270 top
L_MPPT  61,74 180 top
LED1  8,7 180 top
POW  63,42 0 bottom
PTC1  11,51 0 top
Q1  35.5,31.5 270 top
R1  89.25,47.25 90 top
R2  64,78 0 top
R3  35,67 90 top
R4  38,67 270 top
R5  5,47.25 90 top
R6  9,48.25 270 top
R7  75,64 90 top
R8  71,64 90 top
R9  75,69 270 top
R10  71,69 270 top
R11  74,30 90 top
R12  77,30 270 top
R13  70,30 90 top
R14  27,15 90 top
R15  67,30 270 top
R16  54.25,19 90 top
R17  57.25,19 270 top
R18  51.25,19 90 top
R19  48.25,19 270 top
R20  21,15 270 top
R21  11,7 270 top
R22  59,55 270 top
R23  50,56 0 top
R24  63,43 90 top
R25  28,66 180 top
R26  29,63 90 top
R27  21,69 180 top
R28  21,63 180 top
R29  85,51 0 top
R30  25,77 90 top
R31  49,35 0 top
R_RST  43,32 90 top
RS_B  17,66 270 top
RS_S  21,72.75 0 top
SERIAL  35,56 0 top
SOL  11.89,74.7 0 top
T1  55,55 270 top
U2  86,75 0 top
U3  75,75 0 top
U4  94.25,14.25 180 top
U5  24,15 90 top
U7  26,69 180 top
U8  85,48 0 top
U9  33,15 270 top
U10  19.5,77 270 top
U11  54,35 0 top
U12  54,39 0 top
U$1  61.71,35.87 0 bottom
VREG  59,34 270 top
X1  73.23,25.63 180 bottom
X2  52.92,25.63 180 bottom

### Tracks (layer width: path | path; a pad name or v marks a point on that pad's centre or on a via)
12V_OUT
  Top 0.61: U9.8 38.09,16.91 39.37,15.63 | 39.37,15.63 40,15 39.37,14.37 | U9.5 38.09,13.1 39.37,14.37 | U9.6 39.37,14.37 | U9.7 39.37,15.63
  Top 2.184: DC3.1 48.6,9.39 43,15 40,15 39,15
  Bottom 1.676: DC3.1 DC2.1 DC1.1
12V_OUT_EN  (via drill 0.6 pad 1.02)
  Top 0.254: IC1.33 37.19,43.46 34.94,41.21 34.94,40.94
  Top 0.406: 34.94,40.94 v31,37 | v21,18 20.95,16 R20.1
  Bottom 0.406: v31,37 21,27 v21,18
+3V3  (via drill 0.6 pad 1.02)
  Top 0.254: IC1.48 33.97,41.97 34,42 | 42.74,49.74 IC1.24 42.74,49.75 42.99,50.01 43,50 | IC1.9 39.69,38.31 43,35 | VREG.2 58.06,33.06 59,34 59,38.99 POW.4
  Top 0.305: 34,42 v32,40 | 43,35 R_RST.2 44.05,32.95 44.5,32.5 45.5,32.5 46.75,31.25 46.75,29.25 47,29 | 44,29 v43,29
  Top 0.406: 42.99,50.01 C12.2 42.74,49.74 | v32,40 C14.2 30,39 C15.2 | 43,50 C13.2 45,49 v46,48 | v26,57 26,65 27,66 R25.2 26,67.05 26,69.5 26.16,69.66 U7.3 | LED1.A JTAG.1
  Top 0.813: VREG.2 56.06,33.06 52,29 47,29 v43,29
  Top 1.016: C18.2 58,31.08 VREG.2 | JTAG.1 13.65,11.65 15,13 15,19 16,20 40,20 43,23 v43,29
  Bottom 0.406: POW.4 POW.3 | v46,48 49,45 49,35 48,35 42.5,29.5 | v26,57 21,52 21,43 24,40 v32,40
  Bottom 0.813: v32,40 42.5,29.5 v43,29
+5V  (via drill 0.6 pad 1.02)
  Top 0.381: v92.98,50.8 93.08,50.9
  Top 0.61: 61,52.05 v61,52
  Top 0.813: DIS1.2 92.56,51.41 CONTR.CW | IC2.7 72.64,36.63 73,37 | 75,37 77,35 79,35 85,29
  Top 1.016: VREG.3 60.52,33.51 | 60.52,33.51 61.02,33.02 C17.2 | R22.2 61,52.05 | 75,37 73,37 64,37 64,36.99 60.52,33.51 | v98,37 98,45.97 93.08,50.9 92.56,51.41 | L_5V.P$2 92.55,21.7 U4.4 92.55,18.55 92,18 85.44,18 C22.+
  Top 1.27: 92.3,23.25 L_5V.P$2 v90,29 85,29
  Bottom 0.381: v92.98,50.8 92.97,51
  Bottom 1.016: v61,52 62,51 92.97,51 92.98,50.98 | v90,29 v98,37
BATT_I  (via drill 0.6 pad 1.02)
  Top 0.254: IC1.14 44.53,42.47
  Top 0.305: 44.53,42.47 45,42
  Top 0.406: v44,40 45,41 45,42 | U7.6 24.96,54.54 23.75,53.25 v23.75,52.75
  Bottom 0.406: v44,40 36,40 33,43 25,43 23.75,44.25 v23.75,52.75
BATT_V  (via drill 0.6 pad 1.02)
  Top 0.305: IC1.13 43.03,41.97 42.75,41.75
  Top 0.406: 42.75,41.75 v42.75,39
  Top 0.813: R6.2 11.95,47.3 C8.2 15.5,47.25 20.25,52 v22.5,52
  Top 1.016: R5.1 6.3,46.3 7.3,47.3 R6.2
  Bottom 0.406: v42.75,39 35,39 32,42 24,42 22.5,43.5 v22.5,52
CC_EN  (via drill 0.6 pad 1.02)
  Top 0.254: IC1.18 51.47,44.47 v53,46 | 76,57 76,60
  Top 0.406: v53,51 75,51 76,52 76,57 | 76,60 75,61 73.05,61 R8.1
  Bottom 0.406: v53,46 v53,51
CC_PWM  (via drill 0.6 pad 1.02)
  Top 0.254: v55,45 54,44 42.77,44 IC1.17 | 78.5,57.25 78.5,59.75
  Top 0.406: v51,50 76,50 78.5,52.5 78.5,57.25 | 78.5,59.75 78.3,59.75 R7.1
  Bottom 0.406: v51,50 51,46 52,45 v55,45
GND  (via drill 0.6 pad 1.02)
  Top 0.152: C10.2 31.75,65.96 32.15,65.85 | R24.2 63.5,44.45 63.15,44.1 | 24.13,7.62 24.13,8.04 | 46.99,21.59 46.5,21.59 | 63.5,2.54 63.5,3.07 | 64.77,4.43 64.77,3.81 DC2.2
  Top 0.254: IC1.23 44.97,46.97 45,47 47,47 48,48 48,49 v49,50 | IC1.8 39.19,45.81 v39,46
  Top 0.305: 30,42 30.47,42.47 IC1.47 35.47,42.47 36,43 35.96,43.04 35.96,43.57 35.56,43.97 IC1.44
  Top 0.406: C14.1 28.19,40.19 30,42 | IC2.6 71.36,32.63 | 71.25,32.5 67.5,32.5 67,32 R15.1 | 63.5,44.45 63.5,45.5 64,46 68,46 68,39 67.25,38.25 64.75,38.25 C3.1 | U7.2 28,69 28.75,69.75 28.75,70 v28.25,70.5 | U11.2 56,33.98 56,34 57,35 57.92,35 VREG.1 | v87,54 89,52 CONTR.CCW
  Bottom 0.152: 91.36,11.98 91.36,8.17 v91.25,8 | 91.36,11.98 91.36,15.79 v91.25,16 | 91.36,11.98 v91.25,12 | 95.17,11.98 95.17,8.17 v95.25,8 | 95.17,11.98 95.17,15.79 v95.25,16 | 95.17,11.98 v95.25,12
  other vias: 97.25,8 97.25,10 97.25,12 97.25,14 97.25,16 24,34 22,32 26,24 28,24 78.5,30.75 50.75,54.25 38.75,70.25 40.75,70.25 42.75,70.25 26.75,74.5 91.25,10 91.25,14 93.25,8 93.25,10 93.25,12 93.25,14 93.25,16 95.25,10 95.25,14 79.75,63.25 76.5,40.75 77.5,40.75 78.5,40.75 79.5,40.75 80.5,40.75 68.5,38.75 68.5,44.25 33.75,63.25 32.75,63.25 27.25,63.75 11,51 12,52 57,39 57,38 84,45
  pour Top: 0,0 100,0 100,80 0,80
  pour Bottom: 0,0 100,0 100,80 0,80
LCD_BK_EN
  Top 0.254: IC1.19 41.95,44.97 40.32,46.6 40.32,46.7 42.06,48.44 42.06,51.06 | 49,56 R23.1
  Top 0.406: 42.06,51.06 47,56 49,56
LCD_D4
  Top 0.254: IC1.28 39.69,53.69 49,63
  Top 0.406: 49,63 65.2,63 DIS1.11
LCD_D5
  Top 0.254: IC1.27 40.19,53.19 49,62
  Top 0.406: 49,62 63.66,62 DIS1.12
LCD_D6
  Top 0.254: IC1.26 40.69,52.69 49,61
  Top 0.406: 49,61 62.12,61 DIS1.13
LCD_D7
  Top 0.254: IC1.25 41.19,52.19 49,60
  Top 0.406: 49,60 60.58,60 DIS1.14
LCD_E
  Top 0.254: IC1.22 47.47,46.47 50,49
  Top 0.406: 50,49 76.9,49 82.4,54.5 DIS1.6
LCD_RS
  Top 0.254: DIS1.4 87.5,58.5 | IC1.20 50.47,45.47 52,47
  Top 0.406: 52,47 77.98,47 87.48,56.5 DIS1.4
LCD_RW
  Top 0.254: IC1.21 48.97,45.97 51,48
  Top 0.406: 51,48 77.44,48 84.94,55.5 DIS1.5
N$1
  Top 0.254: IC1.3 36.69,38.69 36,38
  Top 0.305: C1.2 32.62,34.25 Q1.1 33.9,35.9 36,38
N$2
  Top 0.254: 90,58.48 DIS1.3
  Top 0.406: CONTR.WIPE 90,58.48
N$3
  Top 0.406: R8.2 72.7,64.95 74,66.25 79.98,66.25 IC3.3
N$4
  Top 0.61: R28.2 16.8,63
  Top 1.422: D1.C 17.45,62.75 RS_B.2
  Top 1.778: PTC1.P$1 7,51 11,55 11,62 12,63 16.8,63 RS_B.2
N$6
  Top 0.406: U2.2 U2.3 U2.1 | U3.5 79.91,73.09 83,70 83,67 83.75,66.25 84.81,66.25 IC3.6 90.73,66.27 C2.2 90,65 90,62.02 D4.C
  Top 0.61: U2.1 U3.8 | U2.2 U3.7 | U2.3 U3.6 U3.5
  Top 1.016: L_MPPT.P$1 62,75 69,75 C5.1
  Top 1.422: U3.8 75.55,79 70,79 C5.1
N$7  (via drill 0.6 pad 1.02)
  Top 0.406: IC3.7 87.46,67.54 v87.5,67.5 | v77,68 75.05,68 R9.2
  Bottom 0.406: v87.5,67.5 77.5,67.5 v77,68
N$8
  Top 0.406: R7.2 76.05,64.95 79,62 81,62 82,63 82,67 81.5,67.5 80.04,67.5 IC3.2
N$9  (via drill 0.6 pad 1.02)
  Top 0.406: v93,72.75 v93,74
N$10
  Top 0.406: IC3.8 85.27,69 D2.C 90,69.03 90,70 93,67 C2.1
N$11
  Top 0.406: R10.1 71,71.74 U3.4
N$12
  Top 0.61: R2.1 47.05,77.95 45.5,76.5 L_MPPT.P$2
  Top 1.016: D3.A 49.55,69.75 L_MPPT.P$2
  Top 1.422: C6.+ D3.A
N$13  (via drill 0.6 pad 1.02)
  Top 0.406: R10.2 71.95,68.05 v73,67 | v87.5,65 IC3.5
  Bottom 0.406: v73,67 75,65 v87.5,65
N$14  (via drill 0.6 pad 1.02)
  Top 0.406: R9.1 75.7,69.95 v77.5,71.75 | v84.5,71.75 84.5,71.95 U2.4
  Bottom 0.406: v77.5,71.75 v84.5,71.75
N$15
  Top 0.61: C5.2 R2.2
N$16  (via drill 0.6 pad 1.02)
  Top 0.406: 92.64,74.36 93,74 | D2.A 94,69 93,70 93,73 | C11.2 97,71 v93,75.25 | IC3.1 v80,70
  Top 0.61: 24,73 24,72.2 RS_S.2 23.55,73 22.75,73 20.41,75.34 U10.2
  Top 0.813: C10.1 34.95,68 R3.2 | v93,75.25 93,74 93,73 92.91,73.09 U2.5 | U2.8 91.09,76.91 v93,75.25 | U2.7 92.36,75.64 v93,75.25 | U2.6 92.36,74.36 v93,75.25
  Top 1.27: C4.+ v30,74.25 28.5,72.75 | RS_S.2 28.5,72.75 | 28.5,72.75 29,72 32,69 C10.1
  Top 1.93: v30,74.25 v30,75.5 v30,76.75 v30,78
  Bottom 0.406: v80,70 88,70 v93,75.25
  Bottom 1.93: v30,78 v30,74.25
  Bottom 2.184: v30,78 91,78 93,76 v93,75.25 93,73
N$18
  Top 0.254: IC1.4 37.19,38.19
  Top 0.305: C9.2 38.38,34.25 Q1.4 37.1,38.1 37.19,38.19
N$19
  Top 0.406: DIS1.15 59.54,57.46 59,57 R22.1
N$20
  Top 0.61: R17.2 55.75,18.05 | 55.75,18.05 R16.1 | X2.2 53.92,23.58 55.75,21.75 55.75,18.05
N$21
  Top 1.27: U4.2 95.7,34.3 89,41 89.75,41 L_5V.P$1 83.05,41.7 D6.C
N$22  (via drill 0.6 pad 1.02)
  Top 0.254: IC1.29 39.19,54.19 41,56 41,57 v41.19,57.19
  Top 0.406: v82,49 R29.1
  Bottom 0.406: v41.19,57.19 53.81,57.19 62,49 v82,49
N$23
  Top 0.254: IC1.46 34.11,43 29,43 14,28
  Top 0.406: 14,28 13.19,28 KEYPAD.1 13,28.57
N$24
  Top 0.254: IC1.45 28.47,43.47 15.92,30.92
  Top 0.406: KEYPAD.2 15.92,30.92
N$25
  Top 0.61: U5.3 24,12 28,12 | 28,12 29.3,12 U9.4 | R14.1 27,13 28,12
N$26
  Top 0.254: IC1.43 28.44,44.47 17.43,33.46
  Top 0.406: KEYPAD.3 17.43,33.46
N$27
  Top 0.254: 19,36 28,45 34.11,45 IC1.42
  Top 0.406: KEYPAD.4 19,36
N$28
  Top 0.254: IC1.41 26.47,45.47 25,44
  Top 0.406: KEYPAD.5 19.54,38.54 25,44
N$29
  Top 0.254: KEYPAD.6 12.92,41.08 13,41 | IC1.40 34.11,46 25,46 24,45
  Top 0.406: 13,41 20,41 24,45
N$30
  Top 0.254: IC1.38 34.11,47 21,47 20,46
  Top 0.406: KEYPAD.7 17.62,43.62 20,46
N$31
  Top 0.406: 57,58.41 DIS1.16 56.1,57.51 T1.C
N$32
  Top 0.406: R23.2 52.02,55.95 T1.B
N$33
  Top 0.381: 73.66,29.21 77.47,29.21 R12.2 | 74.23,28.84 73.66,29.21 | 73.66,29.21 R11.1
  Top 0.406: 74.23,28.84 X1.2
N$34
  Top 0.254: 69.05,29 R13.1
  Top 0.406: X1.3 72.23,26.77 70,29 69.05,29 | R13.1 R15.2
N$35
  Top 0.61: R20.2 22.92,14.05 U5.1
N$36
  Top 0.61: R19.2 49.5,18.05 | 49.5,18.05 R18.1 | X2.3 51.92,23.42 49.75,21.25 49.75,18.3 49.5,18.05
N$37
  Top 0.406: LED1.C 10.9,5.95 R21.2
N$38
  Top 0.61: U10.3 17.98,75.98 18,75 18,72.2 RS_S.1
  Top 0.813: 18.09,72.11 RS_S.1
  Top 2.184: SOL.3 14.89,74.89 17,72.75 RS_S.1
N$39
  Top 0.305: U7.1 26.95,68.25 R25.1 R26.2
N$40
  Top 0.305: U7.4 22.61,69.66 R27.1 21.95,67.05 C20.2
N$41
  Top 0.305: C20.1 22,63.05 R28.1 23,63 23.5,63.5 23.5,68.75 23.75,69 U7.5
N$42
  Top 0.406: U8.3 86.02,48.02 87.75,49.75 89,49.75 | 89,49.75 90.25,49.75 91.75,48.25 BUZZ1.P$2 | R1.2 89,48.2 89,49.75
N$43
  Top 0.406: U8.1 85.02,49.02 86,50 86,50.95 R29.2
N$44
  Top 0.406: C16.2 50,34.95 R31.2 50.97,36.02 U11.1
N$45
  Top 0.406: U12.2 54.02,37.98 55,37 55,35.02 U11.3
N$46
  Top 1.778: BATT.P$1 14.66,52.44 PTC1.P$2
NRST  (via drill 0.6 pad 1.02)
  Top 0.254: 38.69,38.31 IC1.7
  Top 0.305: R_RST.1 41.05,31.05 41,31
  Top 0.406: 38.69,38.31 41,36 41,31 41,27 36,22 8,22 8.19,21.81 JTAG.5 | U12.3 v51,39 | v45.75,30.5 43.55,30.5 R_RST.1
  Bottom 0.406: v51,39 51,30.5 v45.75,30.5
SOL_I  (via drill 0.6 pad 1.02)
  Top 0.254: IC1.12 41.19,38.81
  Top 0.305: 41.19,38.81 43,37 v45,37 | 19.5,75 19.5,74.75 20,74.5
  Top 0.406: 27.05,78 R30.2 | v28,56 28,59.75 28.75,60.5 30.5,60.5 31,61 31,63.75 30.5,64.25 30.5,67.75 v29.5,68.75 | 20,74.5 20,73.25 v21,72
  Top 0.61: U10.1 19.5,75 | D5.C 25.15,78.1 R30.2
  Top 0.813: U10.1 21.98,78.02 C19.2 24.95,78 R30.2
  Bottom 0.406: v45,37 45.5,37.5 45.5,40 44.5,41 38,41 35,44 27,44 25,46 25,54 27,56 v28,56 | v21,72 23,72 26.25,68.75 v29.5,68.75
SOL_V  (via drill 0.6 pad 1.02)
  Top 0.254: IC1.11 40.69,38.31
  Top 0.305: 40.69,38.31 43,36 46,36
  Top 0.406: 46,36 v47,37 | R3.1 35,59 29,59 29,55 31,53 v31,50
  Top 0.813: R3.1 R4.2 40.95,66.05 C7.2
  Bottom 0.406: v47,37 47,40 45,42 39,42 v31,50
SWCLK
  Top 0.254: IC1.37 33.53,47.47 33,48 20,48 17,45 | 10.5,20.5 6.25,20.5
  Top 0.406: 17,45 8.63,45 5,41.35 5,21.5 6,20.5 6.25,20.5 | JTAG.2 10.19,14.19 12,16 12,19 10.5,20.5
SWDIO
  Top 0.254: 16,46 19,49 34,49 36,47 36.51,47 36.69,47.18 IC1.34
  Top 0.406: 16,46 8,46 4,42 4,20.75 5.25,19.5 7.77,19.5 JTAG.4
SWO
  Top 0.254: IC1.39 22.02,46.47 21.3,45.75 21.25,45.75 | 17.93,42.38 7.38,42.38
  Top 0.305: 17.93,42.38 17.93,42.43 21.25,45.75
  Top 0.406: 7.38,42.38 6,41 6,25 6.65,24.35 JTAG.6
USART1_RX
  Top 0.254: IC1.31 38.19,51.81 37,53 34,53 32.5,54.5 32.5,55.96 SERIAL.1
USART1_TX
  Top 0.254: SERIAL.2 35,55 36,54 37,54 38.69,52.31 IC1.30
USB_EN1  (via drill 0.6 pad 1.02)
  Top 0.254: IC1.36 34.69,50.06
  Top 0.406: IC2.1 74,41 v74,46 | 34.69,50.06 33.06,50.06 v33,50
  Bottom 0.406: v74,46 73,47 62,47 56,53 34,53 33,52 v33,50
USB_EN2  (via drill 0.6 pad 1.02)
  Top 0.254: 70,40 IC2.4 | IC1.35 36.19,49.81 v35,51
  Top 0.406: v70,46 70,40
  Bottom 0.406: v70,46 61,46 55,52 35,52 v35,51
USB_FLG1  (via drill 0.6 pad 1.02)
  Top 0.254: IC1.15 50.03,42.97 51,42 | 72.48,39.73 IC2.2
  Top 0.305: 51,42 56,42 v57.25,43
  Top 0.406: v72.75,41.25 72.76,39.73 72.48,39.73
  Bottom 0.406: v57.25,43 59,41.25 v72.75,41.25
USB_FLG2  (via drill 0.6 pad 1.02)
  Top 0.254: IC1.16 56.12,43.47 v57.19,44.54 | 71.5,40 IC2.3
  Top 0.406: v71.5,42.5 71.5,40
  Bottom 0.254: v57.19,44.54 57.46,44.54
  Bottom 0.406: 57.46,44.54 59.5,42.5 v71.5,42.5
USB_OUT1
  Top 0.406: R11.2 R13.2
  Top 0.813: IC2.8 74,34.4 R11.2 74,32 75,33 79,33 80,32 80,27 79,26 77.09,26 X1.1
USB_OUT2  (via drill 0.6 pad 1.02)
  Top 0.254: R18.2 R16.2
  Top 0.61: IC2.5 69.5,35 66,35 63.96,32.96 63.96,26.94 62.65,25.63 X2.1 | R16.2 54.25,20.75 v53,22
  Bottom 0.61: v53,22 53,22.22 X2.1
V_BACKUP  (via drill 0.6 pad 1.02)
  Top 0.254: IC1.1 35.69,39.69 v33,37
  Bottom 0.406: BATT_BCKUP.P+ 24.12,28.12 v33,37
V_LOAD  (via drill 0.6 pad 1.02)
  Top 0.381: v97.75,28 97.79,27.59 97.75,27.59 | 44.45,65.04 D3.C | v30,10 30.48,10.16 30.48,10 | 39.37,61 39.37,60.96 v39.5,61 | v32,10 31.75,10.16 31.75,10 | R1.1 88.9,46.72 87.36,46.72 86.86,46.74 BUZZ1.P$1
  Top 0.406: v96,45 96,37 98,35 98,30.25 v97.75,30
  Top 0.61: R27.2 19,69 18,68 16.2,68 RS_B.1
  Top 0.813: U9.1 30.5,17 32,17 33,16 32.63,15.63 U9.2 28.36,15.63 28,16 27.05,16 R14.2 | U9.3 32.37,14.37 33,15
  Top 1.016: v97.75,30 v97.75,28 97.75,27.59 v97.75,27 97.75,20.25 U4.1 | C21.+ 61,13 v64,13
  Top 1.27: R5.2 2.05,48.2
  Top 1.778: 44.45,65.04 44.45,64.45 v41,61 v39.5,61 39.37,61 v38,61 | v8,56.75 v7,56.75 v6,56.75 2.25,56.75 2,57 | v33,10 33,15 33,16 | 2.05,48.2 2,51
  Top 1.93: 22,10 v29,10 v30,10 30.48,10 v31,10 31.75,10 v32,10 v33,10
  Top 2.184: RS_B.1 14.7,66.5 14,66 5,66 2,63 2,57 2,51 2,5 5,2 14,2 22,10
  Bottom 0.381: 97.73,28.86 97.79,28.86 v97.75,29
  Bottom 0.406: BUZZ1.P$1 88,45 v96,45
  Bottom 1.016: v64,13 v63,13
  Bottom 1.778: v41,61 v38,61 26,61 21.75,56.75 v6,56.75
  Bottom 1.93: 38,10 v29,10
  Bottom 2.184: 38,10 41,13 v62,13 v63,13 79,13 93,27 v97.75,27 | 97.73,26.73 97.73,28.86 97.73,29.98 v97.75,30
WKUP  (via drill 0.6 pad 1.02)
  Top 0.254: POW.1 | 64,42 63.05,42 R24.1 62.95,42 | POW.2 | IC1.10 40.19,43.19 v41,44
  Top 0.406: POW.1 64,42 | POW.2 62,42 62.95,42 | 53,41 v47.75,41 48.05,40.95 R31.1 | 53,41 57,41 59,43 59,43.51 POW.2 | C3.2 62,41.05 R24.1 | U12.1 52.98,40.98 53,41
  Bottom 0.254: v41,44 45,44 v47.75,41

### Text on the board
tNames: RX | TX | GND
bNames: Designed by Ashley Grealish in London / Manufactured in China
Document: M3 Bolt | M3 Bolt | M3 Bolt | M3 Bolt